# Altium schematic sheet [04] - REVISION HISTORY.SchDoc: = ProjectName
size A3; Author: ABC; Organization: Altium Limited; Address1: L3, 12a Rodborough Rd; Address2: Frenchs Forest; Address3: NSW; Address4: Australia 2086; DocumentNumber: 1; SheetNumber: 1; SheetTotal: 1; PROJECT CODE: A_V1.0
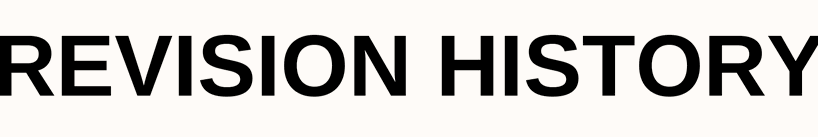
[diagram p0: [04] - REVISION HISTORY.SchDoc]

## Notes on the sheet
- REVISION HISTORY
- TITLE:
- DOCUMENT NAME:
- PROJECT CODE:
- Sheet
- of
- SCALE 1:1
- © PATECH 2023
- TEMPLATE:
- CEO: Alireza Jahanbakhshi
- A3
- AUTHOR: